# Altium schematic sheet top_1.SchDoc
size A4
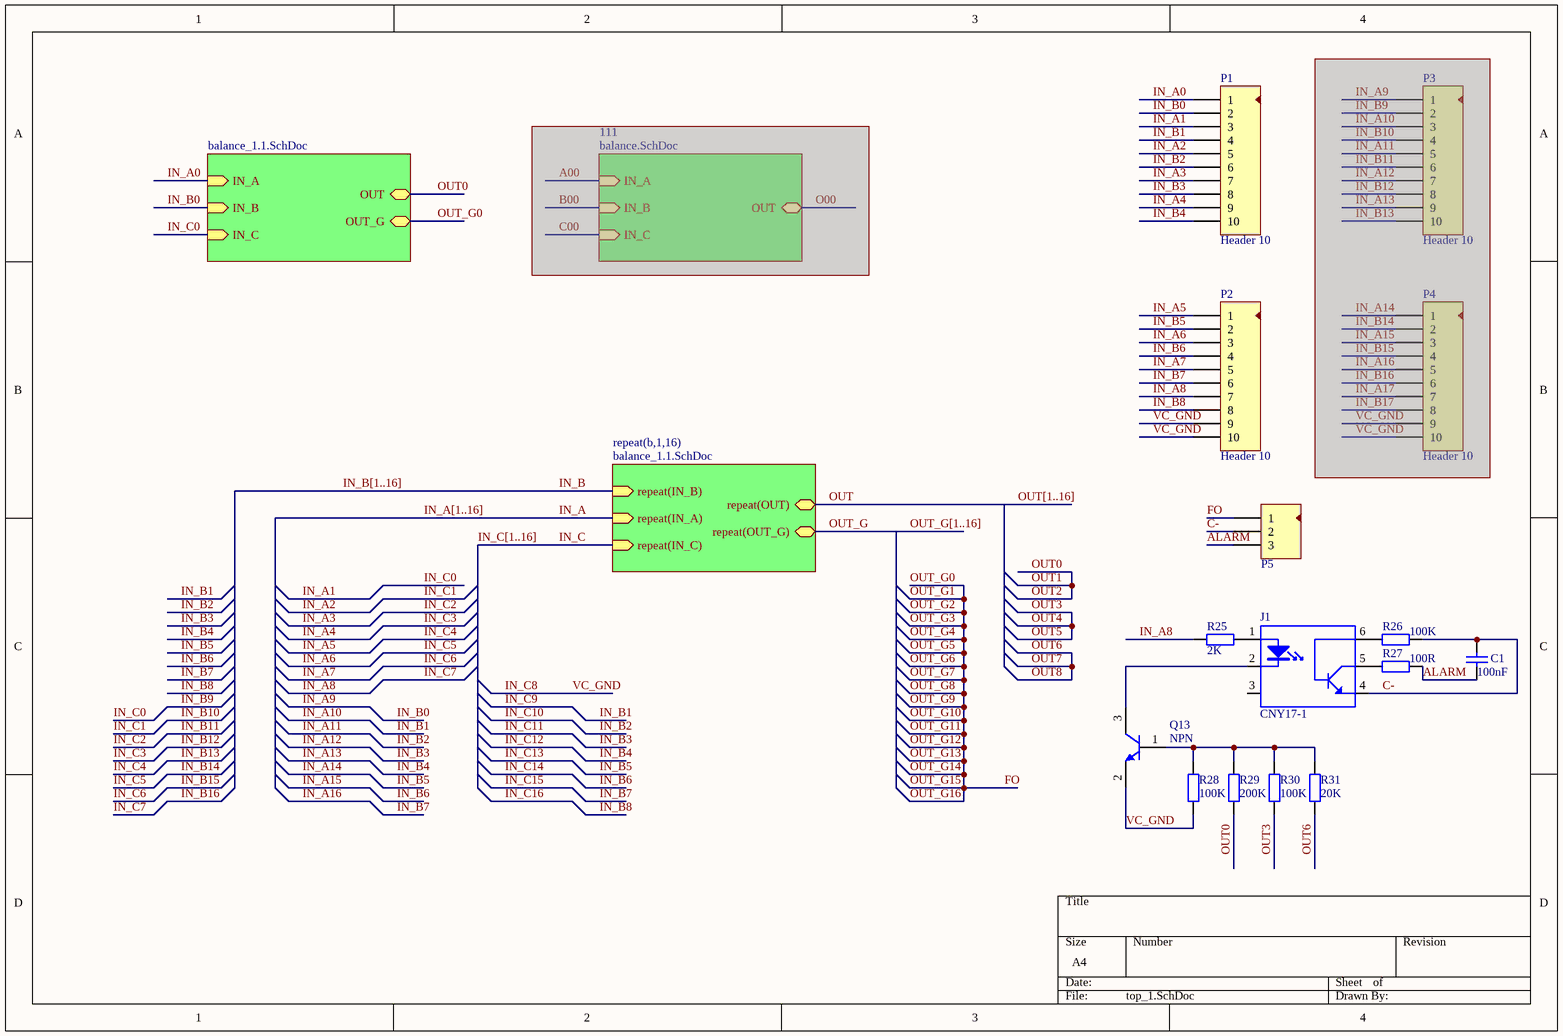
[diagram p0: top_1.SchDoc]

## Parts
C1  value 100nF  [C-0603]  (hidden comment: Cap-S)
J1  CNY17-1  [DIP-6]
P1  Header 10  [HDR10X1-2.54]
P2  Header 10  [HDR10X1-2.54]
P3  Header 10  [HDR10X1-2.54]  (masked out: inside a compile mask, not in the netlist)
P4  Header 10  [HDR10X1-2.54]  (masked out: inside a compile mask, not in the netlist)
P5  Header 3  [HDR3X1-2.54]  (value not drawn)
Q13  NPN  [SOT23-3]
R25  value 2K  [0603-1]  (hidden comment: Res1)
R26  value 100K  [0603-1]  (hidden comment: Res1)
R27  value 100R  [0603-1]  (hidden comment: Res1)
R28  value 100K  [0603-1]  (hidden comment: Res1)
R29  value 200K  [0603-1]  (hidden comment: Res1)
R30  value 100K  [0603-1]  (hidden comment: Res1)
R31  value 20K  [0603-1]  (hidden comment: Res1)

## Sub-sheets
111 = balance.SchDoc (masked out): IN_A (in), IN_B (in), IN_C (in), OUT (bidir)
repeat(b,1,16) = balance_1.1.SchDoc: repeat(IN_B) (in), repeat(IN_A) (in), repeat(IN_C) (in), repeat(OUT) (bidir), repeat(OUT_G) (bidir)
? = balance_1.1.SchDoc: IN_A (in), IN_B (in), IN_C (in), OUT (bidir), OUT_G (bidir)

## Nets
ALARM: C1.1 P5.3 R27.2
C-: C1.2 J1.4(E) P5.2 R26.2
FO: P5.1 ; sheet /OUT_G  [also labelled OUT_G0, OUT_G1, OUT_G10, OUT_G11, OUT_G12, OUT_G13, OUT_G14, OUT_G15, OUT_G16, OUT_G2, OUT_G3, OUT_G4, OUT_G5, OUT_G6, OUT_G7, OUT_G8, OUT_G9]
IN_A: sheet repeat(b,1,16)/repeat(IN_A)
IN_A0: P1.1 ; sheet /IN_A
IN_A1: P1.3 ; sheet /IN_C  [also labelled IN_B9, IN_C0]
IN_A2: P1.5  [also labelled IN_B10, IN_C1]
IN_A3: P1.7  [also labelled IN_B11, IN_C2]
IN_A4: P1.9  [also labelled IN_B12, IN_C3]
IN_A5: P2.1  [also labelled IN_B13, IN_C4]
IN_A6: P2.3  [also labelled IN_B14, IN_C5]
IN_A7: P2.5  [also labelled IN_B15, IN_C6]
IN_A8: P2.7 R25.1  [also labelled IN_B16, IN_C7]
IN_A9: P1.2 ; sheet /IN_B  [also labelled IN_B0]
IN_A10: P1.4  [also labelled IN_B1, IN_C9]
IN_A11: P1.6  [also labelled IN_B2, IN_C10]
IN_A12: P1.8  [also labelled IN_B3, IN_C11]
IN_A13: P1.10  [also labelled IN_B4, IN_C12]
IN_A14: P2.2  [also labelled IN_B5, IN_C13]
IN_A15: P2.4  [also labelled IN_B6, IN_C14]
IN_A16: P2.6  [also labelled IN_B7, IN_C15]
IN_B: sheet repeat(b,1,16)/repeat(IN_B)
IN_B8: P2.8  [also labelled IN_C16]
IN_C: sheet repeat(b,1,16)/repeat(IN_C)
IN_C8: P2.9 P2.10 Q13.2(E) R28.1  [also labelled VC_GND]
OUT: sheet repeat(b,1,16)/repeat(OUT)
OUT0: R29.1 ; sheet /OUT  [also labelled OUT1, OUT2]
OUT3: R30.1  [also labelled OUT4, OUT5]
OUT6: R31.1  [also labelled OUT7, OUT8]
OUT_G: sheet repeat(b,1,16)/repeat(OUT_G)
NetJ1_1: J1.1(A) R25.2
NetJ1_2: J1.2(K) Q13.3(C)
NetJ1_5: J1.5(C) R27.1
NetJ1_6: J1.6(B) R26.1
NetQ13_1: Q13.1(B) R28.2 R29.2 R30.2 R31.2

Not connected (* = marked no-connect by the designer): J1 3(NC)

## Buses and harness runs
bus IN_A[1..16]
bus IN_B[1..16]
bus IN_C[1..16]
bus OUT[1..16]
bus OUT_G[1..16]

## Library data of the parts
C1 = Cap-S: 贴片瓷片电容; Published: 8-Jun-2000; LatestRevisionDate: 17-Jul-2002; LatestRevisionNote: Re-released for DXP Platform.; PackageReference: RAD-0.3; Publisher: Altium Limited
J1 = CNY17-1: 光电耦合器
P1-P4 = Header 10: 接插件; LatestRevisionDate: 17-Jul-2002; LatestRevisionNote: Re-released for DXP Platform.; Publisher: Altium Limited
P5 = Header 3: 接插件; LatestRevisionDate: 17-Jul-2002; LatestRevisionNote: Re-released for DXP Platform.; Publisher: Altium Limited
Q13 = NPN1: 贴片三极管; Published: 8-Jun-2000; LatestRevisionDate: 15-Jan-2003; LatestRevisionNote: PCB Footprint 'BCY-W3/D4.7' replaced; DatasheetDocument: 1997; PackageDocument: Sep-1998; PackageReference: TO-92A; Publisher: Altium Limited; Code_JEDEC: TO-92A; ComponentLink1Description: Manufacturer Link; ComponentLink1URL: http://www.fairchildsemi.com/; ComponentLink2Description: Datasheet; ComponentLink2URL: http://www.fairchildsemi.com/ds/2N%2F2N3904.pdf
R25-R31 = Res1: 贴片电阻; Published: 8-Jun-2000; LatestRevisionDate: 17-Jul-2002; LatestRevisionNote: Re-released for DXP Platform.; PackageReference: AXIAL-0.4; Publisher: Altium Limited